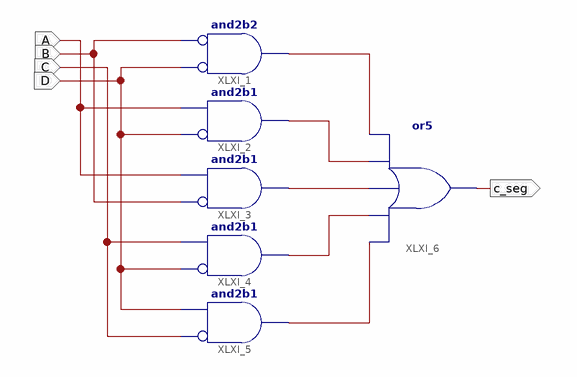
[diagram p0: schematic sheet 1]
// Xilinx ISE schematic bcd4to7c.sch (spartan6) as structural Verilog: 6 symbols, 5 ports
module bcd4to7c (
  input  A,
  input  B,
  input  C,
  input  D,
  output c_seg
);

  wire XLXN_1, XLXN_2, XLXN_3, XLXN_4, XLXN_5;

  and XLXI_1 (XLXN_1, ~D, ~B);  // and2b2
  and XLXI_2 (XLXN_2, ~D, A);  // and2b1
  and XLXI_3 (XLXN_3, ~B, A);  // and2b1
  and XLXI_4 (XLXN_4, ~D, C);  // and2b1
  and XLXI_5 (XLXN_5, ~C, D);  // and2b1
  or XLXI_6 (c_seg, XLXN_5, XLXN_4, XLXN_3, XLXN_2, XLXN_1);
endmodule
